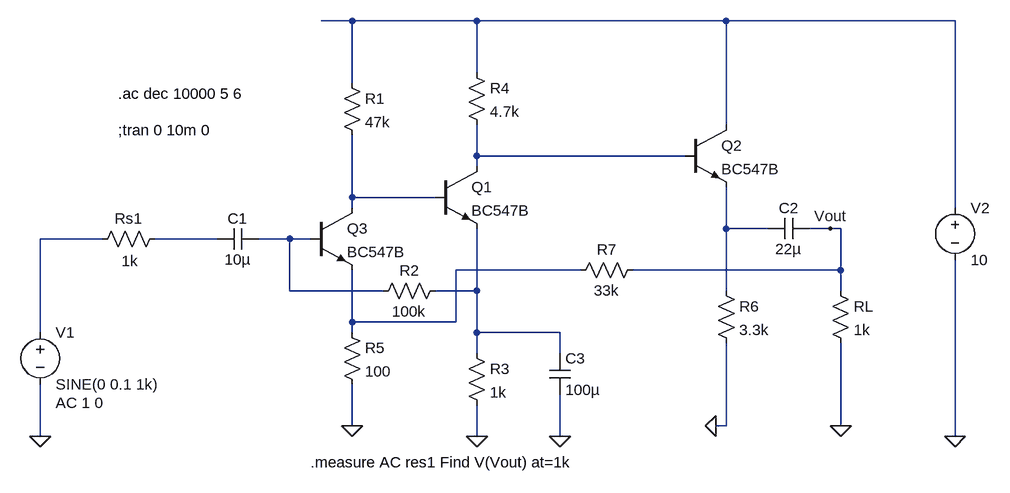
[diagram p0: schematic c1_v2.asc]
c1_v2.asc, the LTspice schematic file:
Version 4
SHEET 1 1052 680
WIRE 64 -128 16 -128
WIRE 256 -128 64 -128
WIRE 640 -128 256 -128
WIRE 992 -128 640 -128
WIRE 256 -48 256 -128
WIRE 64 -32 64 -128
WIRE 640 32 640 -128
WIRE 256 80 256 32
WIRE 576 80 256 80
WIRE 256 96 256 80
WIRE 64 144 64 48
WIRE 192 144 64 144
WIRE 64 160 64 144
WIRE 992 160 992 -128
WIRE 640 192 640 128
WIRE 704 192 640 192
WIRE 800 192 768 192
WIRE 816 192 800 192
WIRE -320 208 -416 208
WIRE -144 208 -240 208
WIRE -32 208 -80 208
WIRE 0 208 -32 208
WIRE 416 256 224 256
WIRE 816 256 816 192
WIRE 816 256 496 256
WIRE -32 288 -32 208
WIRE 112 288 -32 288
WIRE 256 288 256 192
WIRE 256 288 192 288
WIRE 640 288 640 192
WIRE 816 288 816 256
WIRE 64 336 64 256
WIRE 224 336 224 256
WIRE 224 336 64 336
WIRE -416 352 -416 208
WIRE 64 352 64 336
WIRE 256 352 256 288
WIRE 384 352 256 352
WIRE 256 384 256 352
WIRE 384 384 384 352
WIRE 64 496 64 432
WIRE 640 496 640 368
WIRE 640 496 624 496
WIRE 816 496 816 368
WIRE -416 512 -416 432
WIRE 256 512 256 464
WIRE 384 512 384 448
WIRE 992 512 992 240
FLAG -416 512 0
FLAG 992 512 0
FLAG 256 512 0
FLAG 384 512 0
FLAG 624 496 0
FLAG 816 496 0
FLAG 64 496 0
FLAG 800 192 Vout
SYMBOL npn 192 96 R0
SYMATTR InstName Q1
SYMATTR Value BC547B
SYMBOL res 240 -64 R0
SYMATTR InstName R4
SYMATTR Value 4.7k
SYMBOL res 240 368 R0
SYMATTR InstName R3
SYMATTR Value 1k
SYMBOL voltage 992 144 R0
SYMATTR InstName V2
SYMATTR Value 10
SYMBOL cap 368 384 R0
SYMATTR InstName C3
SYMATTR Value 100µ
SYMBOL npn 576 32 R0
SYMATTR InstName Q2
SYMATTR Value BC547B
SYMBOL res 624 272 R0
SYMATTR InstName R6
SYMATTR Value 3.3k
SYMBOL voltage -416 336 R0
WINDOW 123 24 124 Left 2
WINDOW 39 0 0 Left 2
SYMATTR Value2 AC 1 0
SYMATTR InstName V1
SYMATTR Value SINE(0 0.1 1k)
SYMBOL res 800 272 R0
SYMATTR InstName RL
SYMATTR Value 1k
SYMBOL cap 768 176 R90
WINDOW 0 0 32 VBottom 2
WINDOW 3 32 32 VTop 2
SYMATTR InstName C2
SYMATTR Value 22µ
SYMBOL npn 0 160 R0
SYMATTR InstName Q3
SYMATTR Value BC547B
SYMBOL res 48 -48 R0
SYMATTR InstName R1
SYMATTR Value 47k
SYMBOL res 48 336 R0
SYMATTR InstName R5
SYMATTR Value 100
SYMBOL res -224 192 R90
WINDOW 0 0 56 VBottom 2
WINDOW 3 34 54 VTop 2
SYMATTR InstName Rs1
SYMATTR Value 1k
SYMBOL cap -80 192 R90
WINDOW 0 0 32 VBottom 2
WINDOW 3 32 32 VTop 2
SYMATTR InstName C1
SYMATTR Value 10µ
SYMBOL res 208 272 R90
WINDOW 0 0 56 VBottom 2
WINDOW 3 32 56 VTop 2
SYMATTR InstName R2
SYMATTR Value 100k
SYMBOL res 512 240 R90
WINDOW 0 0 56 VBottom 2
WINDOW 3 32 56 VTop 2
SYMATTR InstName R7
SYMATTR Value 33k
TEXT 0 552 Left 2 !.measure AC res1 Find V(Vout) at=1k
TEXT -296 40 Left 2 !;tran 0 10m 0
TEXT -296 -16 Left 2 !.ac dec 10000 5 6

The netlist it stands for:
* c1_v2.asc
Q1 N002 N003 N009 0 BC547B
R4 N001 N002 4.7k
R3 N009 0 1k
V2 N001 0 10
C3 N009 0 100µ
Q2 N001 N002 N004 0 BC547B
R6 N004 0 3.3k
V1 N005 0 SINE(0 0.1 1k) AC 1 0
RL Vout 0 1k
C2 Vout N004 22µ
Q3 N003 N007 N008 0 BC547B
R1 N001 N003 47k
R5 N008 0 100
Rs1 N006 N005 1k
C1 N007 N006 10µ
R2 N009 N007 100k
R7 Vout N008 33k
.model NPN NPN
.model PNP PNP
.lib standard.bjt
.measure AC res1 Find V(Vout) at=1k
;tran 0 10m 0
.ac dec 10000 5 6
.backanno
.end